# EAGLE design untitled (EAGLE 7.6.0)
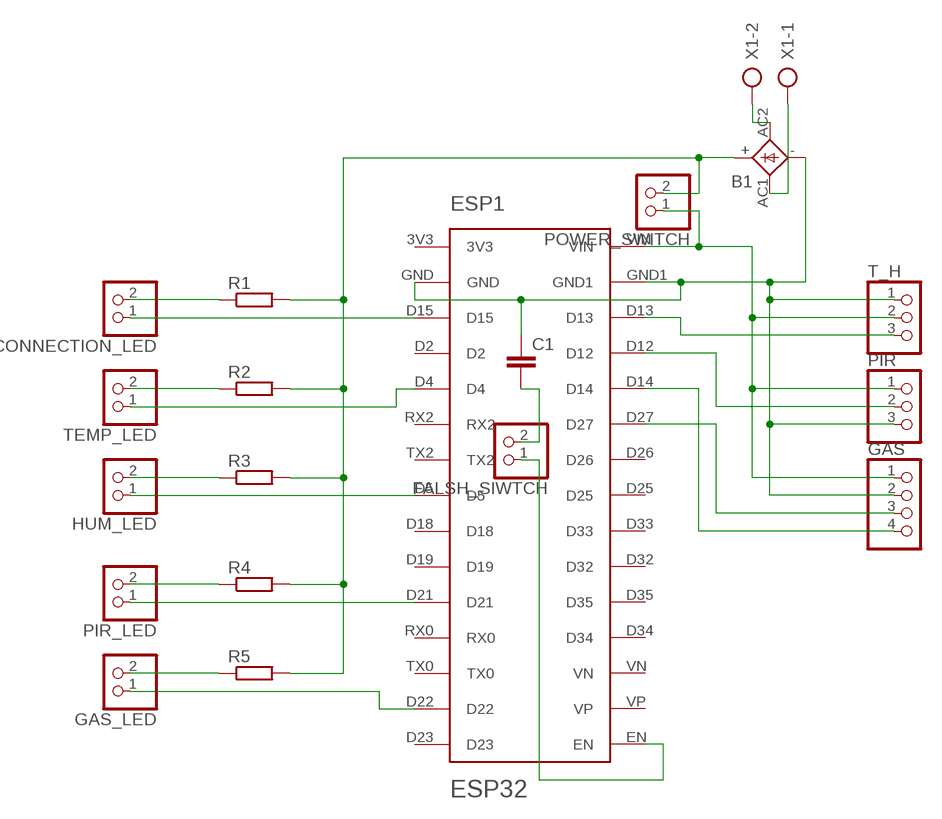
[diagram p0: schematic, sheet 1]

## Parts
B1  2KBB-R  [2KBB-R]
C1  C5/2.5  [C5B2.5]
CONNECTION_LED  PINHD-1X2  [1X02]
ESP1  ESP32  [ESP-32]
FALSH_SIWTCH  PINHD-1X2  [1X02]
GAS  PINHD-1X4  [1X04]
GAS_LED  PINHD-1X2  [1X02]
HUM_LED  PINHD-1X2  [1X02]
PIR  PINHD-1X3  [1X03]
PIR_LED  PINHD-1X2  [1X02]
POWER_SWITCH  PINHD-1X2  [1X02]
R1  R-EU_0207/10  [0207/10]
R2  R-EU_0207/10  [0207/10]
R3  R-EU_0207/10  [0207/10]
R4  R-EU_0207/10  [0207/10]
R5  R-EU_0207/10  [0207/10]
T_H  PINHD-1X3  [1X03]
TEMP_LED  PINHD-1X2  [1X02]
X1  AK300/2  [AK300/2]

## Nets
N$2: B1.AC2 X1.2
N$3 [signaal]: ESP1.D13 T_H.3
N$4 [signaal]: ESP1.D12 PIR.2
N$5 [signaal]: ESP1.D27 GAS.3
N$6 [signaal]: ESP1.D14 GAS.4
N$7: B1.- C1.1 ESP1.GND ESP1.GND1 GAS.2 PIR.3 T_H.1
N$8: B1.AC1 X1.1
N$9: B1.+ POWER_SWITCH.2 R1.2 R2.2 R3.2 R4.2 R5.2
N$10 [signaal]: CONNECTION_LED.1 ESP1.D15
N$11 [signaal]: ESP1.D4 TEMP_LED.1
N$12 [signaal]: ESP1.D5 HUM_LED.1
N$13 [signaal]: ESP1.D21 PIR_LED.1
N$14 [signaal]: ESP1.D22 GAS_LED.1
N$18: GAS_LED.2 R5.1
N$19: PIR_LED.2 R4.1
N$20: HUM_LED.2 R3.1
N$21: R2.1 TEMP_LED.2
N$22: CONNECTION_LED.2 R1.1
N$23: ESP1.VIN GAS.1 PIR.1 POWER_SWITCH.1 T_H.2
N$24: C1.2 FALSH_SIWTCH.2
N$25: ESP1.EN FALSH_SIWTCH.1
Unconnected: ESP1.3V3 ESP1.D2 ESP1.D18 ESP1.D19 ESP1.D23 ESP1.D25 ESP1.D26 ESP1.D32 ESP1.D33 ESP1.D34 ESP1.D35 ESP1.RX0 ESP1.RX2 ESP1.TX0 ESP1.TX2 ESP1.VN ESP1.VP

## Library data of the parts
B1 = rectifier:2KBB-R: RECTIFIER grid 3 x 5 mm
C1 = capacitor-wima:C: CAPACITOR naming: grid - package width
CONNECTION_LED FALSH_SIWTCH GAS_LED HUM_LED PIR_LED POWER_SWITCH TEMP_LED = pinhead:PINHD-1X2: PIN HEADER
ESP1 = ESP-32:ESP32
GAS = pinhead:PINHD-1X4: PIN HEADER
PIR T_H = pinhead:PINHD-1X3: PIN HEADER
R1-R5 = resistor:R-EU_: RESISTOR, European symbol
X1 = con-ptr500:AK300/2: CONNECTOR; OC_FARNELL: unknown; OC_NEWARK: unknown

## Net classes
0 power: width 1 mm
1 signaal: width 1.5 mm

## Board
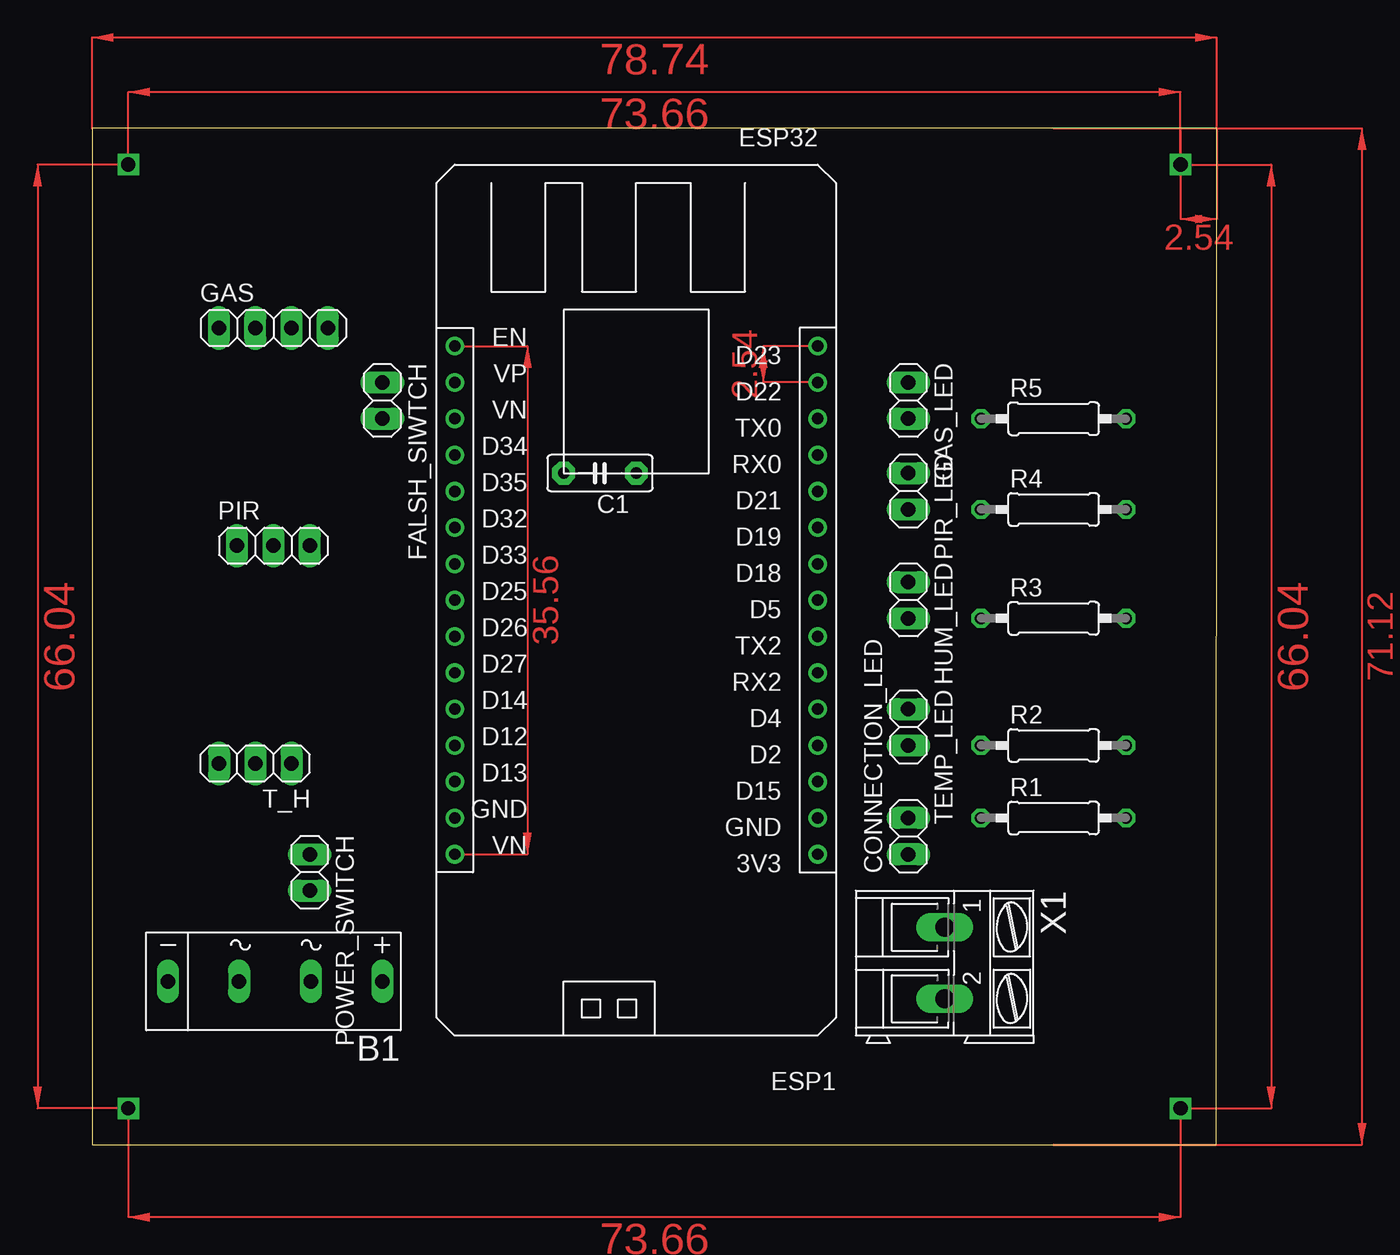
[diagram p1: board, top side]
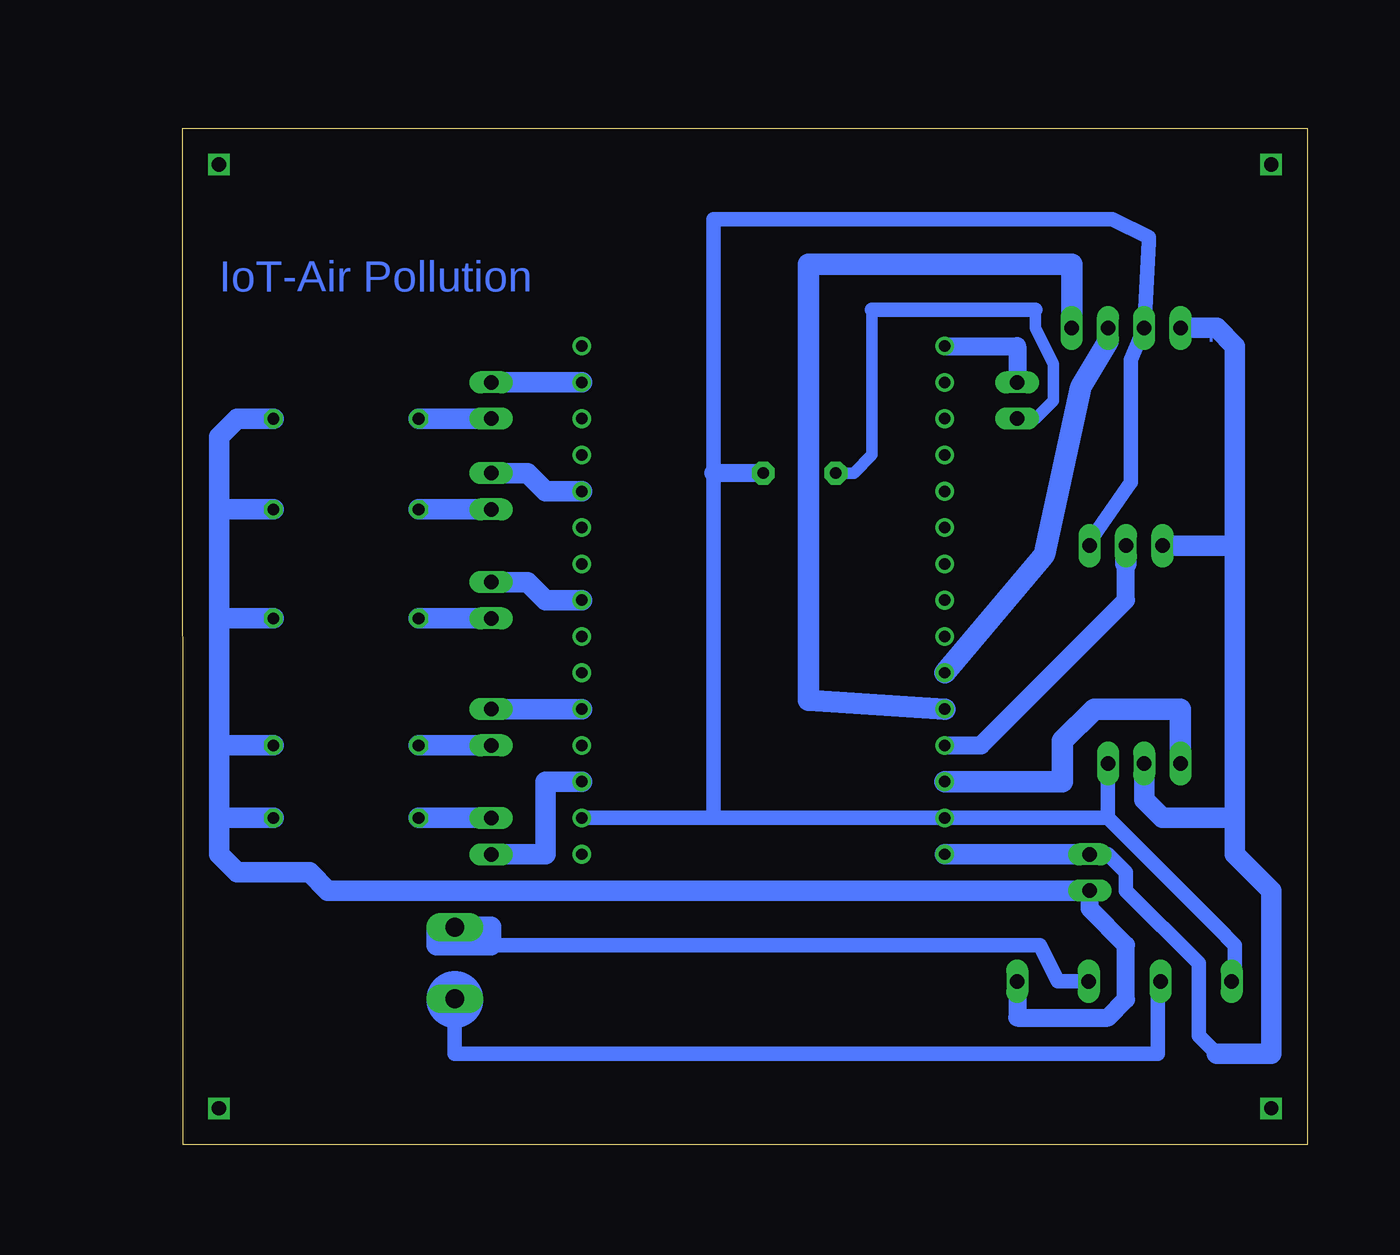
[diagram p2: board, bottom side, seen from below]

Size 78.74 x 71.12 mm. Coordinates in mm from the lower left corner, seen from the top.
Outline: 0,0 78.72,0 78.74,71.12 0,71.12 0,0
Copper layers (1*16): Top 0.035mm / dielectric 1.5mm / Bottom 0.035mm
Design rules "default": minimum track width 10mil, minimum drill 24mil, track to track 8mil, track to pad 8mil, pad to pad 8mil, via to via 8mil, smd to smd 8mil, copper to edge 40mil, drill to drill 8mil, minimum pad ring 10mil, minimum via ring 8mil, stop-mask expansion 4mil, vias tented up to drill 0mil, thermal gap 10mil

### Footprints (pad centres in the part's own frame; a part is rotated, then mirrored left to right if it is on the bottom)
2KBB-R = drill 1.016 long: + -7.62,0; - 7.391,0; AC1 -2.616,0; AC2 2.413,0
C5B2.5 = drill 0.813 pad 1.6 octagon: 1 -2.54,0; 2 2.54,0
1X02 = drill 1.016 long: 1 -1.27,0; 2 1.27,0
ESP-32 = drill 0.8: 3V3 12.7,-26.67; D2 20.32,-26.67; D4 22.86,-26.67; D5 30.48,-26.67; D12 20.32,-1.27; D13 17.78,-1.27; D14 22.86,-1.27; D15 17.78,-26.67; D18 33.02,-26.67; D19 35.56,-26.67; D21 38.1,-26.67; D22 45.72,-26.67; D23 48.26,-26.67; D25 30.48,-1.27; D26 27.94,-1.27; D27 25.4,-1.27; D32 35.56,-1.27; D33 33.02,-1.27; D34 40.64,-1.27; D35 38.1,-1.27; EN 48.26,-1.27; GND 15.24,-1.27; GND1 15.24,-26.67; RX0 40.64,-26.67; RX2 25.4,-26.67; TX0 43.18,-26.67; TX2 27.94,-26.67; VIN 12.7,-1.27; VN 43.18,-1.27; VP 45.72,-1.27
1X04 = drill 1.016 long: 1 -3.81,0; 2 -1.27,0; 3 1.27,0; 4 3.81,0
1X03 = drill 1.016 long: 1 -2.54,0; 2 0,0; 3 2.54,0
0207/10 = drill 0.813 octagon: 1 -5.08,0; 2 5.08,0
AK300/2 = drill 1.321 long: 1 -2.515,0; 2 2.489,0

### Placement (x,y rotation side)
B1  12.7,11.43 180 top
C1  35.56,46.99 180 top
CONNECTION_LED  57.15,21.59 90 top
ESP1  24.13,7.62 90 top
FALSH_SIWTCH  20.32,52.07 270 top
GAS  12.7,57.15 0 top
GAS_LED  57.15,52.07 270 top
HUM_LED  57.15,38.1 270 top
PIR  12.7,41.91 0 top
PIR_LED  57.15,45.72 270 top
POWER_SWITCH  15.24,19.05 270 top
R1  67.31,22.86 0 top
R2  67.31,27.94 0 top
R3  67.31,36.83 0 top
R4  67.31,44.45 0 top
R5  67.31,50.8 0 top
T_H  11.43,26.67 180 top
TEMP_LED  57.15,29.21 270 top
X1  59.69,12.7 270 top

### Tracks (layer width: path | path; a pad name or v marks a point on that pad's centre or on a via)
N$1  (via drill 1)
  other vias: 2.54,68.58
N$2
  Bottom 1: X1.2 59.69,6.35 10.48,6.35 10.48,11.43 B1.AC2
N$3
  Bottom 1.5: ESP1.D13 17.15,25.4 17.15,28.26 14.92,30.48 8.89,30.48 T_H.3
N$4
  Bottom 1.27: ESP1.D12 22.86,27.94 12.7,38.1 PIR.2
  Bottom 1.5: PIR.2 12.7,40.64
N$5
  Bottom 1.5: ESP1.D27 18.42,41.28 15.88,53.02 13.97,56.2 GAS.3
N$6
  Bottom 1.5: ESP1.D14 34.93,31.11 34.93,61.59 16.51,61.59 GAS.4
N$7
  Bottom 1: PIR.3 15.24,42.23 12.38,46.36 12.38,54.93 GAS.2 11.11,63.18 11.11,63.5 13.65,64.77 41.59,64.77 41.59,46.99 41.59,22.86 | 13.97,22.86 ESP1.GND 41.59,22.86 | T_H.1 13.97,22.86 | 41.59,22.86 ESP1.GND1 | 13.97,22.86 6.35,15.24 | 5.4,11.43 B1.-
  Bottom 1.016: 6.35,15.24 5.08,13.97 5.08,11.66 B1.-
  Bottom 1.27: C1.1 41.59,46.99
N$8
  Bottom 1: B1.AC1 17.46,11.43 18.73,13.97 57.15,13.97 | X1.1 59.69,13.97
  Bottom 1.422: 59.69,15.24 60.96,15.24 60.96,13.97 59.69,13.97 | 59.69,13.97 59.69,15.24 | 59.69,15.24 57.15,15.24 57.15,13.97 59.69,13.97
N$9
  Bottom 1.27: B1.+ 20.32,8.89 13.97,8.89 12.7,10.16 12.7,13.97 15.24,16.51 POWER_SWITCH.2
  Bottom 1.422: R5.2 74.93,50.8 76.2,49.53 76.2,44.45 | 76.2,44.45 76.2,36.83 | 76.2,36.83 76.2,27.94 | R2.2 76.2,27.94 | R3.2 76.2,36.83 | R4.2 76.2,44.45 | 76.2,27.94 76.2,22.86 | 76.2,22.86 76.2,20.32 74.93,19.05 69.85,19.05 68.58,17.78 POWER_SWITCH.2 | R1.2 76.2,22.86
N$10
  Bottom 1.422: CONNECTION_LED.1 53.34,20.32 53.34,25.4 ESP1.D15
N$11
  Bottom 1.422: TEMP_LED.1 ESP1.D4
N$12
  Bottom 1.422: HUM_LED.1 54.61,39.37 53.34,38.1 ESP1.D5
N$13
  Bottom 1.422: PIR_LED.1 54.61,46.99 53.34,45.72 ESP1.D21
N$14
  Bottom 1.422: GAS_LED.1 ESP1.D22
N$15  (via drill 1)
  other vias: 76.2,68.58
N$16  (via drill 1)
  other vias: 2.54,2.54
N$17  (via drill 1)
  other vias: 76.2,2.54
N$18
  Bottom 1.422: R5.1 GAS_LED.2
N$19
  Bottom 1.422: R4.1 PIR_LED.2
N$20
  Bottom 1.422: R3.1 HUM_LED.2
N$21
  Bottom 1.422: R2.1 TEMP_LED.2
N$22
  Bottom 1.422: R1.1 CONNECTION_LED.2
N$23
  Bottom 1.016: 6.35,6.35 7.62,7.62 7.62,12.7 12.7,17.78 12.7,19.05 13.97,20.32 POWER_SWITCH.1
  Bottom 1.422: POWER_SWITCH.1 ESP1.VIN | GAS.1 6.35,57.15 5.08,55.88 5.08,41.91 | 5.08,41.91 5.08,22.86 | 5.08,22.86 5.08,20.32 2.54,17.78 2.54,6.35 6.35,6.35 | T_H.2 11.43,24.13 10.16,22.86 5.08,22.86 | PIR.1 5.08,41.91
N$24
  Bottom 0.813: 19.05,58.42 19.05,57.15 17.78,54.61 17.78,52.07 19.05,50.8 FALSH_SIWTCH.2 | C1.2 31.75,46.99 30.48,48.26 30.48,58.42
  Bottom 1.016: 30.48,58.42 19.05,58.42
N$25
  Bottom 1.27: ESP1.EN 20.32,55.88 FALSH_SIWTCH.1
(copper drawn outside any net)
  shapes: Bottom circle x1, Top area x9

### Text on the board
Bottom: IoT-Air Pollution | +